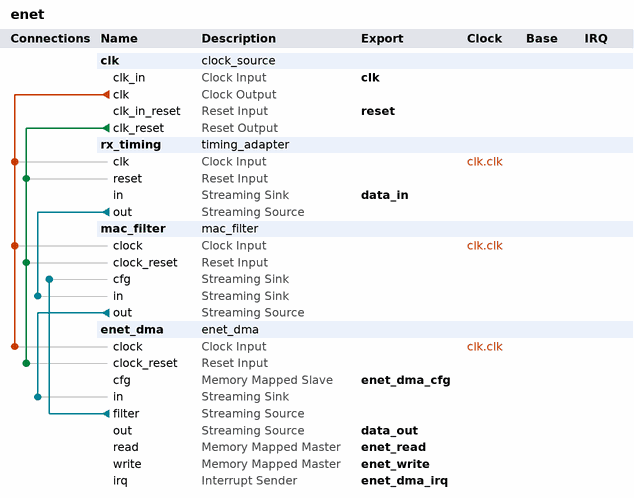
[diagram p0: system contents]
# Platform Designer (Qsys) system enet, Arria II GX EP2AGX125EF35C4
# Parameters at their usual value, and those the tool derives, are not listed.
package require -exact qsys 16.1
create_system enet
set_project_property DEVICE_FAMILY {Arria II GX}
set_project_property DEVICE EP2AGX125EF35C4

add_instance clk clock_source 16.1
set_instance_parameter_value clk clockFrequency 50000000
set_instance_parameter_value clk clockFrequencyKnown false

add_instance rx_timing timing_adapter 16.1
set_instance_parameter_value rx_timing inBitsPerSymbol 8
set_instance_parameter_value rx_timing inChannelWidth 0
set_instance_parameter_value rx_timing inErrorWidth 6
set_instance_parameter_value rx_timing inMaxChannel 0
set_instance_parameter_value rx_timing inReadyLatency 2
set_instance_parameter_value rx_timing inSymbolsPerBeat 4
set_instance_parameter_value rx_timing inUseEmptyPort AUTO
set_instance_parameter_value rx_timing inUsePackets true
set_instance_parameter_value rx_timing inUseReady true
set_instance_parameter_value rx_timing inUseValid true
set_instance_parameter_value rx_timing outReadyLatency 0
set_instance_parameter_value rx_timing outUseReady true
set_instance_parameter_value rx_timing outUseValid true

add_instance mac_filter mac_filter 16.1
set_instance_parameter_value mac_filter enableBypass false

add_instance enet_dma enet_dma 16.1

# connections
add_connection clk.clk enet_dma.clock clock
add_connection clk.clk mac_filter.clock clock
add_connection clk.clk rx_timing.clk clock
add_connection clk.clk_reset enet_dma.clock_reset reset
add_connection clk.clk_reset mac_filter.clock_reset reset
add_connection clk.clk_reset rx_timing.reset reset
add_connection enet_dma.filter mac_filter.cfg avalon_streaming
add_connection mac_filter.out enet_dma.in avalon_streaming
add_connection rx_timing.out mac_filter.in avalon_streaming

# exported interfaces
add_interface clk clock sink
set_interface_property clk EXPORT_OF clk.clk_in
add_interface data_in avalon_streaming sink
set_interface_property data_in EXPORT_OF rx_timing.in
add_interface data_out avalon_streaming source
set_interface_property data_out EXPORT_OF enet_dma.out
add_interface enet_dma_cfg avalon slave
set_interface_property enet_dma_cfg EXPORT_OF enet_dma.cfg
add_interface enet_dma_irq interrupt sender
set_interface_property enet_dma_irq EXPORT_OF enet_dma.irq
add_interface enet_read avalon master
set_interface_property enet_read EXPORT_OF enet_dma.read
add_interface enet_write avalon master
set_interface_property enet_write EXPORT_OF enet_dma.write
add_interface reset reset sink
set_interface_property reset EXPORT_OF clk.clk_in_reset

set_interconnect_requirement {$system} qsys_mm.clockCrossingAdapter HANDSHAKE
set_interconnect_requirement {$system} qsys_mm.enableEccProtection FALSE
set_interconnect_requirement {$system} qsys_mm.insertDefaultSlave FALSE
set_interconnect_requirement {$system} qsys_mm.maxAdditionalLatency 1

save_system enet.qsys
